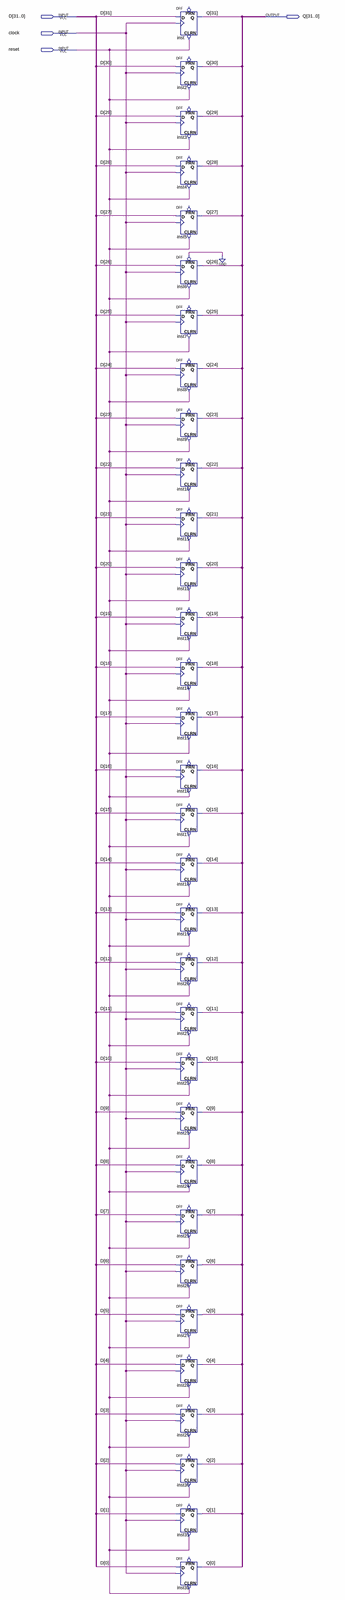
[diagram p0: schematic sheet, whole]
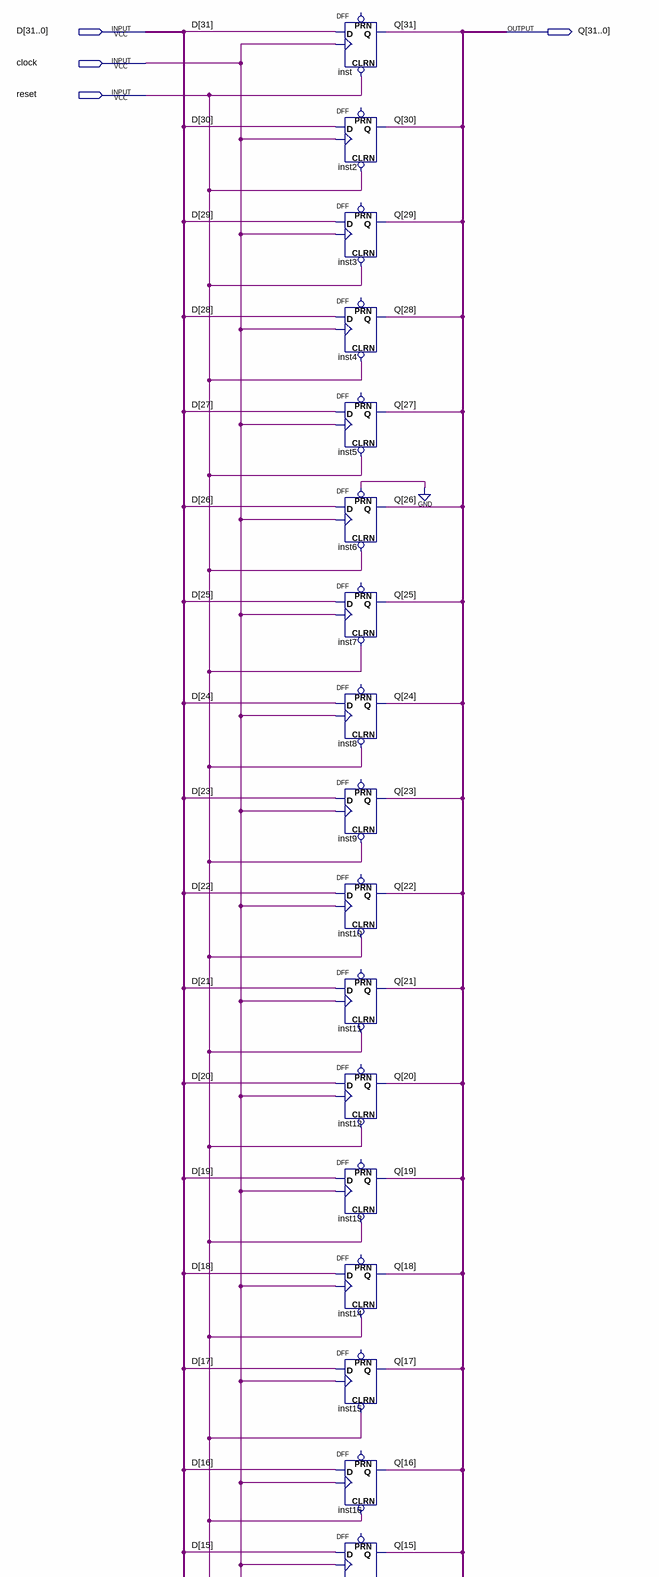
[diagram p1: schematic sheet, upper part]
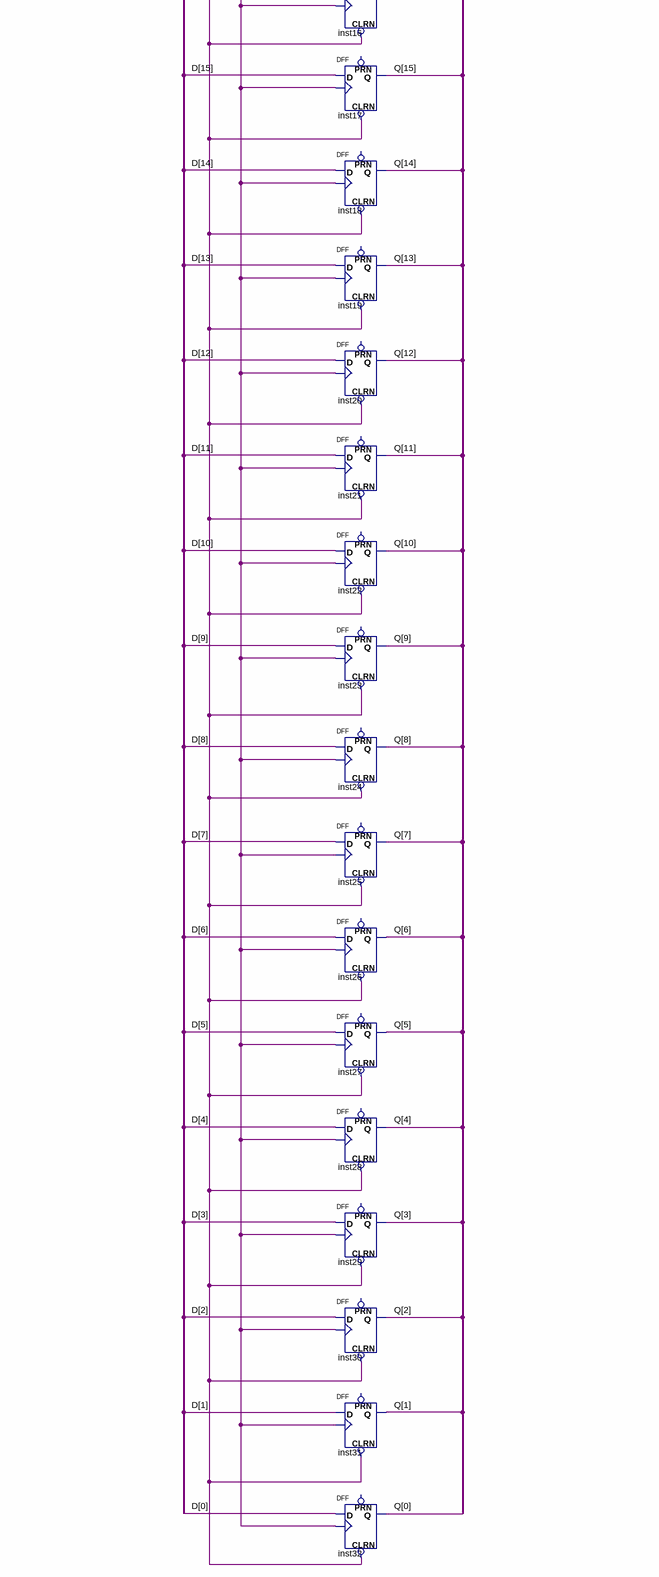
[diagram p2: schematic sheet, lower part]
// Quartus schematic pc.bdf as structural Verilog: 32 symbols, 4 pins
module pc (
  input  [31:0] D,
  input  clock,
  input  reset,
  output [31:0] Q
);

  DFF inst (.CLRN(reset), .CLK(clock), .D(D[31]), .Q(Q[31]));  // open: PRN
  DFF inst2 (.CLRN(reset), .CLK(clock), .D(D[30]), .Q(Q[30]));  // open: PRN
  DFF inst3 (.CLRN(reset), .CLK(clock), .D(D[29]), .Q(Q[29]));  // open: PRN
  DFF inst4 (.CLRN(reset), .CLK(clock), .D(D[28]), .Q(Q[28]));  // open: PRN
  DFF inst5 (.CLRN(reset), .CLK(clock), .D(D[27]), .Q(Q[27]));  // open: PRN
  DFF inst6 (.CLRN(reset), .CLK(clock), .D(D[26]), .PRN(1'b0), .Q(Q[26]));
  DFF inst7 (.CLRN(reset), .CLK(clock), .D(D[25]), .Q(Q[25]));  // open: PRN
  DFF inst8 (.CLRN(reset), .CLK(clock), .D(D[24]), .Q(Q[24]));  // open: PRN
  DFF inst9 (.CLRN(reset), .CLK(clock), .D(D[23]), .Q(Q[23]));  // open: PRN
  DFF inst10 (.CLRN(reset), .CLK(clock), .D(D[22]), .Q(Q[22]));  // open: PRN
  DFF inst11 (.CLRN(reset), .CLK(clock), .D(D[21]), .Q(Q[21]));  // open: PRN
  DFF inst12 (.CLRN(reset), .CLK(clock), .D(D[20]), .Q(Q[20]));  // open: PRN
  DFF inst13 (.CLRN(reset), .CLK(clock), .D(D[19]), .Q(Q[19]));  // open: PRN
  DFF inst14 (.CLRN(reset), .CLK(clock), .D(D[18]), .Q(Q[18]));  // open: PRN
  DFF inst15 (.CLRN(reset), .CLK(clock), .D(D[17]), .Q(Q[17]));  // open: PRN
  DFF inst16 (.CLRN(reset), .CLK(clock), .D(D[16]), .Q(Q[16]));  // open: PRN
  DFF inst17 (.CLRN(reset), .CLK(clock), .D(D[15]), .Q(Q[15]));  // open: PRN
  DFF inst18 (.CLRN(reset), .CLK(clock), .D(D[14]), .Q(Q[14]));  // open: PRN
  DFF inst19 (.CLRN(reset), .CLK(clock), .D(D[13]), .Q(Q[13]));  // open: PRN
  DFF inst20 (.CLRN(reset), .CLK(clock), .D(D[12]), .Q(Q[12]));  // open: PRN
  DFF inst21 (.CLRN(reset), .CLK(clock), .D(D[11]), .Q(Q[11]));  // open: PRN
  DFF inst22 (.CLRN(reset), .CLK(clock), .D(D[10]), .Q(Q[10]));  // open: PRN
  DFF inst23 (.CLRN(reset), .CLK(clock), .D(D[9]), .Q(Q[9]));  // open: PRN
  DFF inst24 (.CLRN(reset), .CLK(clock), .D(D[8]), .Q(Q[8]));  // open: PRN
  DFF inst25 (.CLRN(reset), .CLK(clock), .D(D[7]), .Q(Q[7]));  // open: PRN
  DFF inst26 (.CLRN(reset), .CLK(clock), .D(D[6]), .Q(Q[6]));  // open: PRN
  DFF inst27 (.CLRN(reset), .CLK(clock), .D(D[5]), .Q(Q[5]));  // open: PRN
  DFF inst28 (.CLRN(reset), .CLK(clock), .D(D[4]), .Q(Q[4]));  // open: PRN
  DFF inst29 (.CLRN(reset), .CLK(clock), .D(D[3]), .Q(Q[3]));  // open: PRN
  DFF inst30 (.CLRN(reset), .CLK(clock), .D(D[2]), .Q(Q[2]));  // open: PRN
  DFF inst31 (.CLRN(reset), .CLK(clock), .D(D[1]), .Q(Q[1]));  // open: PRN
  DFF inst32 (.CLRN(reset), .CLK(clock), .D(D[0]), .Q(Q[0]));  // open: PRN
endmodule
